# EAGLE design BD0008 (EAGLE 9.5.2)
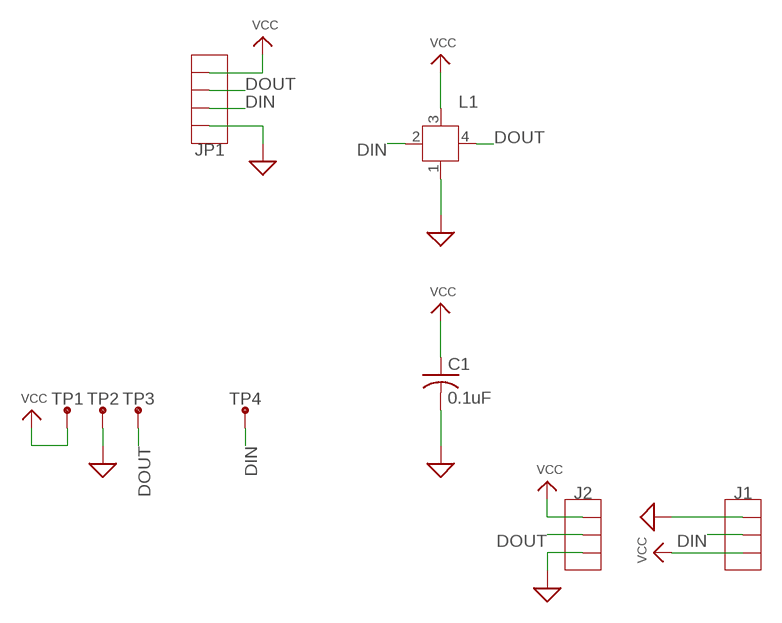
[diagram p0: schematic, sheet 1]

## Parts
C1  0.1uF  C-USC0402  [C0402]
J1  HEADER_1X3MALE  [M3SMD]
J2  HEADER_1X3FEMALE  [F3SMD]
JP1  HEADER_1X4S  [1X04]
L1  WS2812B  [SK6812]
TP1  VCC  TEST_POINT  [TEST_POINT]
TP2  GND  TEST_POINT  [TEST_POINT]
TP3  DOUT  TEST_POINT  [TEST_POINT]
TP4  DIN  TEST_POINT  [TEST_POINT]

## Nets
DIN: J1.2 JP1.2 L1.2(DIN) TP4.P$1
DOUT: J2.2A J2.2B JP1.3 L1.4(DOUT) TP3.P$1
GND: C1.2 J1.1 J2.3A J2.3B JP1.1 L1.1(VSS) TP2.P$1 ; supply symbol labelled SUP
VCC: C1.1 J1.3 J2.1A J2.1B JP1.4 L1.3(VDD) TP1.P$1

## Library data of the parts
C1 = adafruit:C-US: CAPACITOR, American symbol
J1 J2 = Clock:HEADER_1X3
JP1 = Clock:HEADER_1X4S
L1 = Clock:WS2812B
TP1-TP4 = Clock:TEST_POINT

## Board
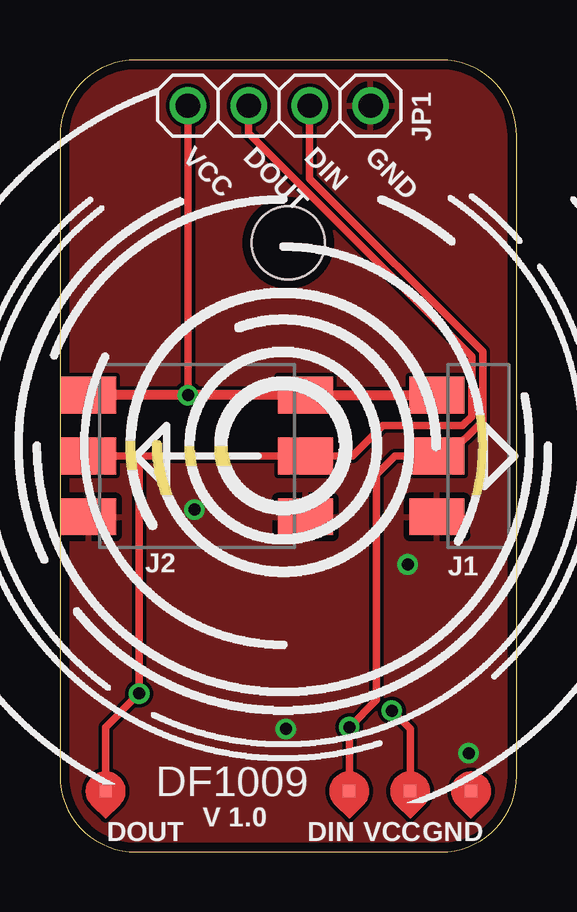
[diagram p1: board, top side]
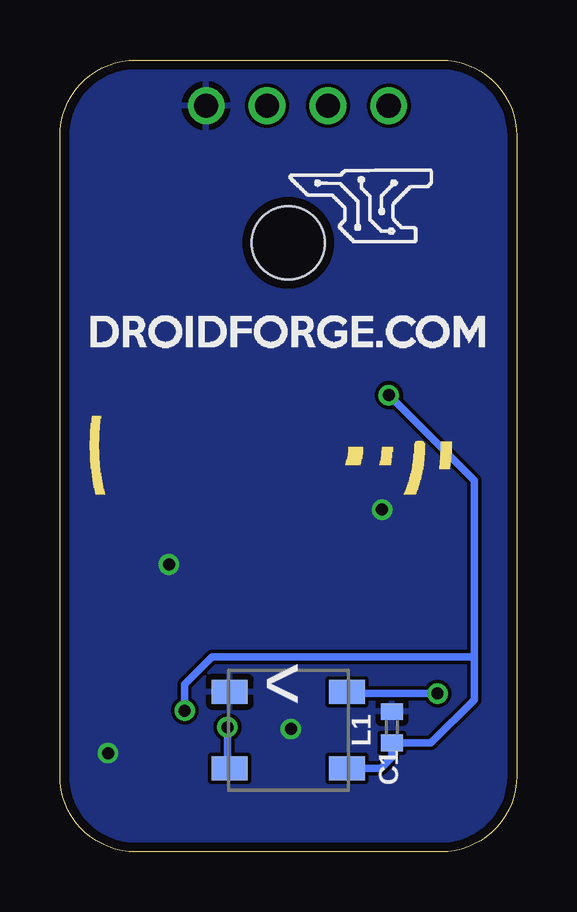
[diagram p2: board, bottom side, seen from below]

Size 19.05 x 33.02 mm. Coordinates in mm from the lower left corner, seen from the top.
Outline: 0,29.84 0,3.17 arc90 3.17,0 15.88,0 arc90 19.05,3.17 19.05,29.84 arc90 15.88,33.02 3.17,33.02 arc90 0,29.84
Copper layers (1*16): Top 0.035mm / dielectric 1.5mm / Bottom 0.035mm
Design rules "default *": minimum track width 6mil, minimum drill 0.35mm, track to track 6mil, track to pad 6mil, pad to pad 6mil, via to via 6mil, smd to smd 6mil, copper to edge 15mil, drill to drill 6mil, minimum pad ring 10mil, minimum via ring 7mil, stop-mask expansion 3mil, vias tented up to drill 25mil, thermal gap 10mil
Holes 3.05 mm at 9.53,25.4
Milling: area 4.2,14.9 to 4.7,14.9; area 17.2,14.9 to 17.5,14.9; area 4.2,14.9 to 4.7,14.9; area 17.2,14.9 to 17.5,14.9; area 4.2,14.9 to 4.7,15; area 17.2,14.9 to 17.6,15; area 4.2,15 to 4.7,15; area 17.2,15 to 17.6,15; area 4.2,15 to 4.6,15; area 17.2,15 to 17.6,15; area 4.2,15 to 4.6,15; area 17.2,15 to 17.6,15; 308 more areas

### Footprints (pad centres in the part's own frame; a part is rotated, then mirrored left to right if it is on the bottom)
C0402 = smd 0.7 x 0.9: 1 -0.65,0; 2 0.65,0
M3SMD = smd 1.524 x 2.286: 1 -2.54,4.521; 2 0,4.521; 3 2.54,4.521
F3SMD = smd 1.524 x 2.286: 1A -2.54,4.521; 1B -2.54,-4.521; 2A 0,4.521; 2B 0,-4.521; 3A 2.54,4.521; 3B 2.54,-4.521
1X04 = drill 1.016: 1 -2.54,0; 2 0,0; 3 2.54,0; 4 5.08,0
SK6812 = smd 1.5 x 1: 1 -2.45,1.6; 2 -2.45,-1.6; 3 2.45,-1.6; 4 2.45,1.6
TEST_POINT = smd 0.508 x 0.508: P$1 0,0

### Placement (x,y rotation side)
C1  5.21,5.21 90 bottom
J1  20.24,16.51 90 top
J2  5.71,16.51 270 top
JP1  10.41,31.11 180 top
L1  9.53,5.08 0 bottom
TP1  14.61,2.54 0 top
TP2  17.14,2.54 0 top
TP3  1.91,2.54 0 top
TP4  12.06,2.54 0 top

### Tracks (layer width: path | path; a pad name or v marks a point on that pad's centre or on a via)
DIN  (via drill 0.5)
  Top 0.305: JP1.2 10.41,28.07 17.63,20.85 17.63,17.97 16.16,16.51 J1.2 13.97,16.51 13.21,15.75 13.21,6.35 v12.06,5.21 TP4.P$1
  Bottom 0.305: L1.2 12.06,3.57 v12.06,5.21
DOUT  (via drill 0.5)
  Top 0.305: J2.2B 3.3,16.51 | 3.3,16.51 J2.2A 12.19,16.51 13.46,17.78 16.79,17.78 17.17,18.16 17.17,20.66 7.87,29.96 JP1.3 | TP3.P$1 1.91,5.21 v3.3,6.6 3.3,16.51
  Bottom 0.305: v3.3,6.6 7,6.6 L1.4
GND  (via drill 0.5)
  other vias: 5.61,14.27 14.5,11.99 9.42,5.13 17.04,4.11
  pour Top: -2.54,-2.54 21.59,-2.54 21.59,35.56 -2.54,35.56
  pour Bottom: -2.54,-2.54 21.59,-2.54 21.59,35.56 -2.54,35.56
VCC  (via drill 0.5)
  Top 0.305: JP1.4 v5.33,19.05 | v13.84,5.89 14.61,5.13 TP1.P$1
  Top 0.406: J2.1B v5.33,19.05 J2.1A J1.3
  Bottom 0.305: L1.3 5.66,3.48 5.21,3.94 C1.1 3.57,4.56 1.78,6.35 1.78,8.13 | v5.33,19.05 1.78,15.49 1.78,8.13 | v13.84,5.89 13.84,6.99 12.7,8.13 1.78,8.13

### Text on the board
tPlace: VCC | DOUT | DIN | GND | DF1009 | V 1.0